# EAGLE schematic simpleBot (EAGLE 9.6.2)

## Sheet 1 of 2
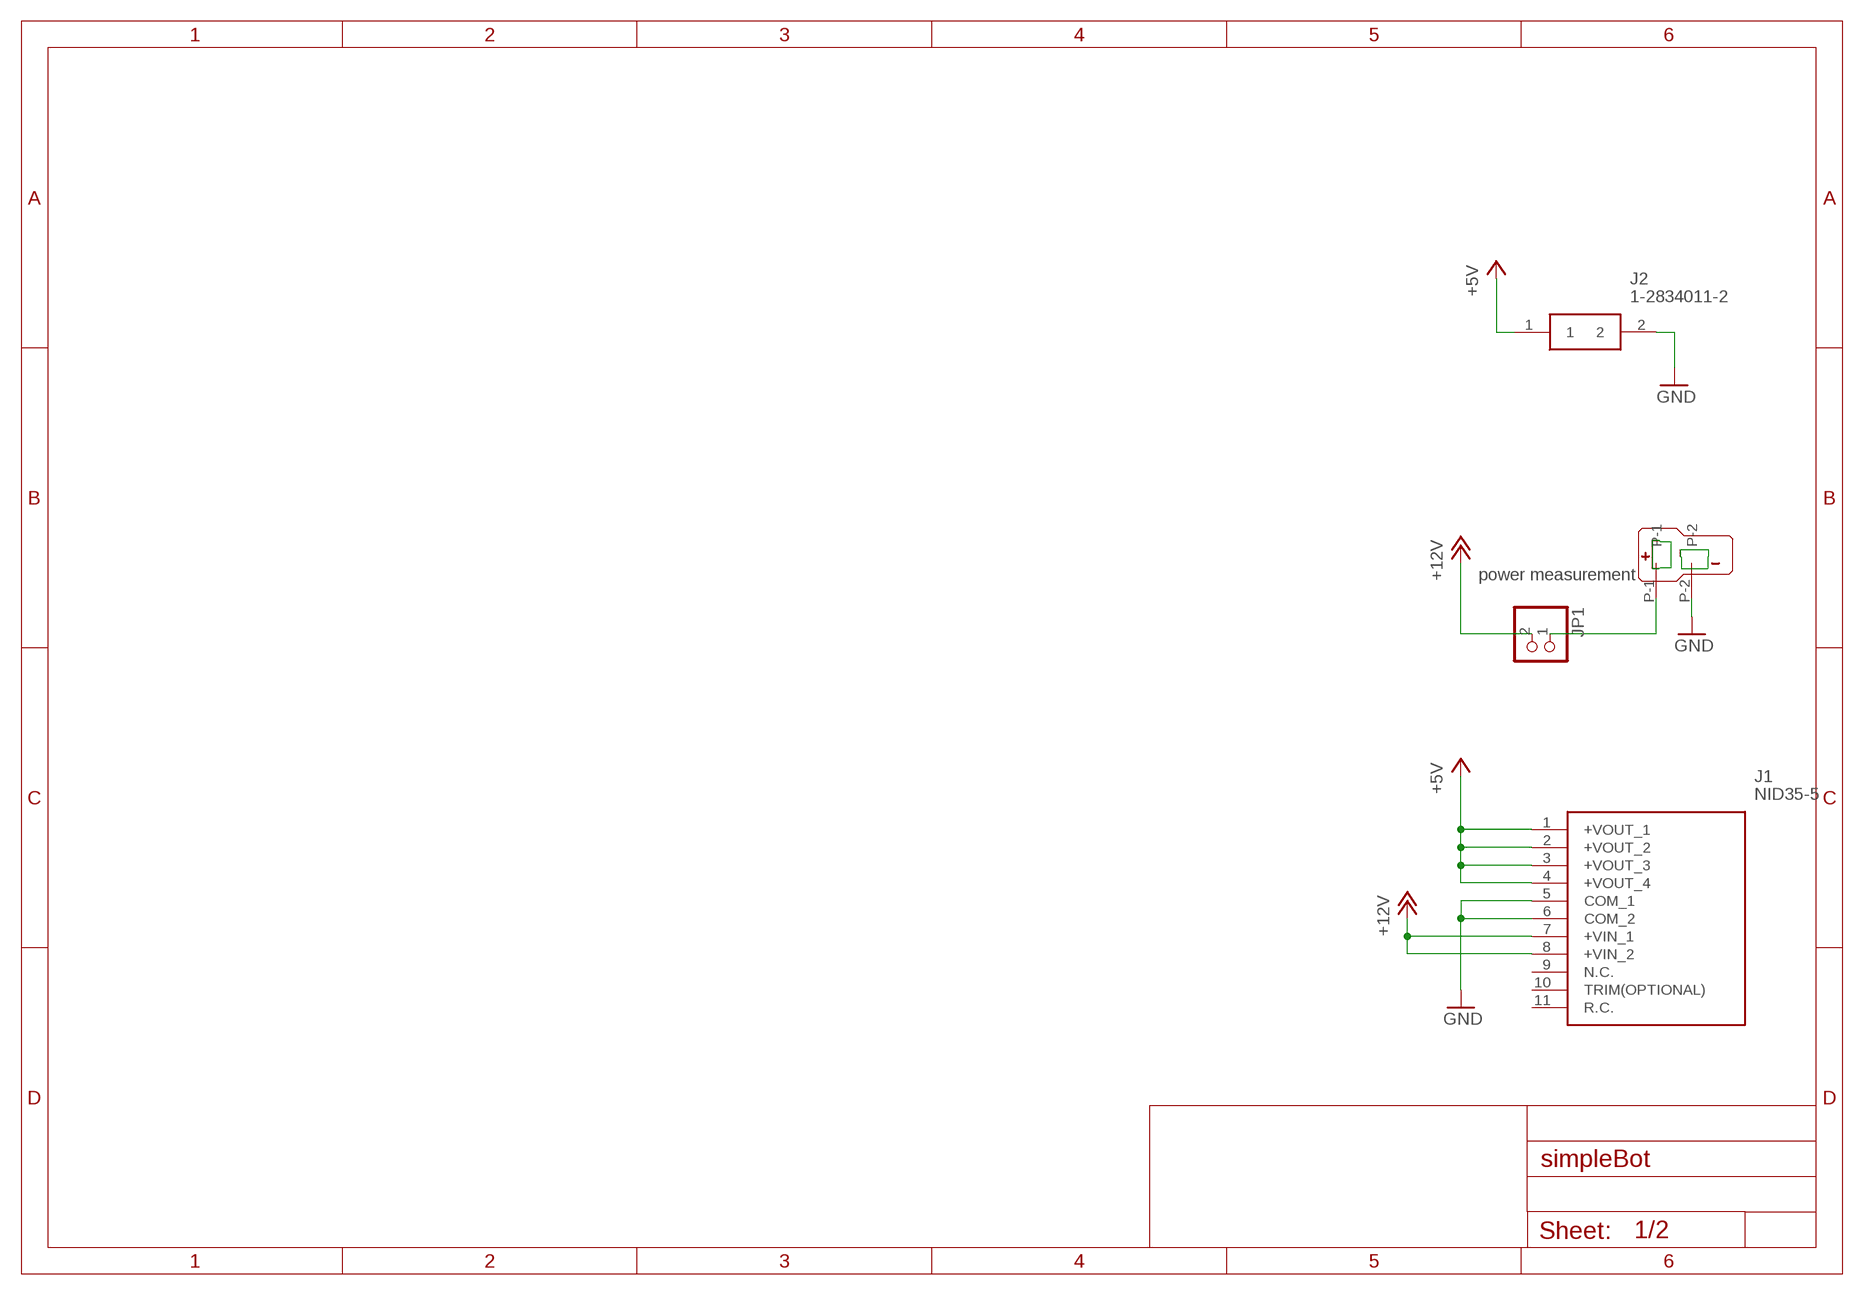
[diagram p0: schematic, sheet 1]

### Parts
J1  NID35-5  [NID355]
J2  1-2834011-2  [128340112]
JP1  PINHD-1X2  [1X02]
U$2  T-PLUG_CONNECTOR  [T_PLUG_CONNECTOR]

### Nets
+5V: J1.1(+VOUT_1) J1.2(+VOUT_2) J1.3(+VOUT_3) J1.4(+VOUT_4) J2.1
+12V: J1.7(+VIN_1) J1.8(+VIN_2) JP1.2
GND: J1.5(COM_1) J1.6(COM_2) J2.2 U$2.P-2 ; also sheet 2
N$3: JP1.1 U$2.P-1
Unconnected: J1.9(N.C.) J1.10(TRIM(OPTIONAL)) J1.11(R.C.)

### Notes on the sheet
- power measurement

## Sheet 2 of 2
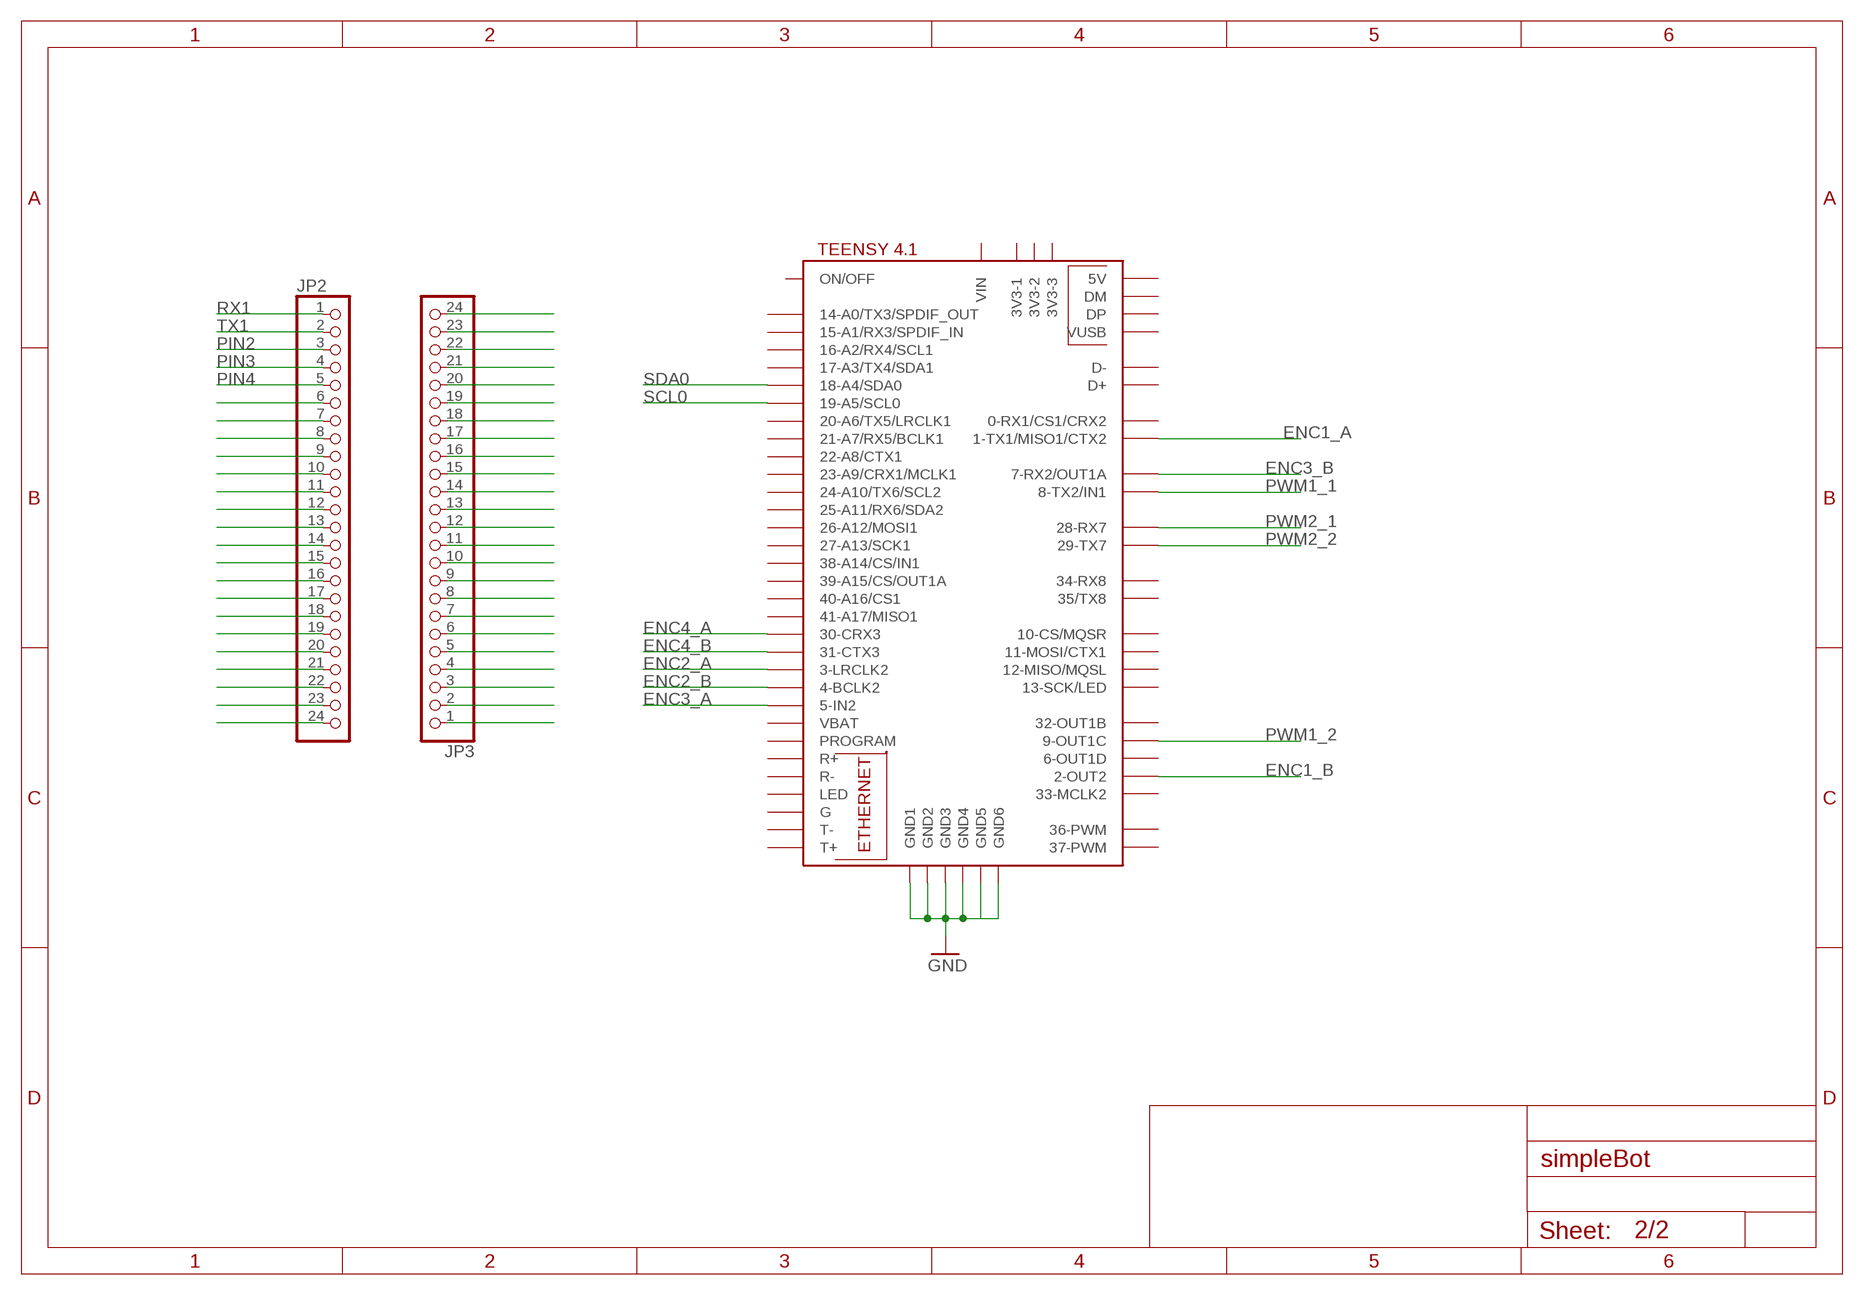
[diagram p1: schematic, sheet 2]

### Parts
JP2  PINHD-1X24  [1X24]
JP3  PINHD-1X24  [1X24]
U$1  TEENSY41  [TEENSY41]

### Nets
ENC1_A: U$1.1-TX1/MISO1/CTX2
ENC1_B: U$1.2-OUT2
ENC2_A: U$1.3-LRCLK2
ENC2_B: U$1.4-BCLK2
ENC3_A: U$1.5-IN2
ENC3_B: U$1.7-RX2/OUT1A
ENC4_A: U$1.30-CRX3
ENC4_B: U$1.31-CTX3
GND: U$1.GND1 U$1.GND2 U$1.GND3 U$1.GND4 U$1.GND5 U$1.GND6 ; also sheet 1
N$7: JP2.6
N$8: JP2.7
N$9: JP2.8
N$10: JP2.9
N$11: JP2.10
N$12: JP2.11
N$13: JP2.12
N$14: JP2.13
N$15: JP2.14
N$16: JP2.15
N$17: JP2.16
N$18: JP2.17
N$19: JP2.18
N$20: JP2.19
N$21: JP2.20
N$22: JP2.21
N$23: JP3.24
N$24: JP3.23
N$25: JP3.22
N$26: JP3.21
N$27: JP3.20
N$28: JP3.19
N$29: JP3.18
N$31: JP3.17
N$32: JP3.16
N$33: JP3.15
N$34: JP3.14
N$35: JP3.13
N$36: JP3.12
N$38: JP3.11
N$39: JP3.10
N$40: JP3.9
N$41: JP3.8
N$42: JP3.7
N$43: JP3.6
N$44: JP3.5
N$45: JP3.4
N$46: JP3.3
N$47: JP3.2
N$48: JP3.1
N$49: JP2.22
N$50: JP2.23
N$51: JP2.24
PIN2: JP2.3
PIN3: JP2.4
PIN4: JP2.5
PWM1_1: U$1.8-TX2/IN1
PWM1_2: U$1.9-OUT1C
PWM2_1: U$1.28-RX7
PWM2_2: U$1.29-TX7
RX1: JP2.1
SCL0: U$1.19-A5/SCL0
SDA0: U$1.18-A4/SDA0
TX1: JP2.2
Unconnected: U$1.0-RX1/CS1/CRX2 U$1.3V3-1 U$1.3V3-2 U$1.3V3-3 U$1.6-OUT1D U$1.10-CS\MQSR(10-CS/MQSR) U$1.11-MOSI/CTX1 U$1.12-MISO/MQSL U$1.13-SCK/LED U$1.14-A0/TX3/SPDIF_OUT U$1.15-A1/RX3/SPDIF_IN U$1.16-A2/RX4/SCL1 U$1.17-A3/TX4/SDA1 U$1.20-A6/TX5/LRCLK1 U$1.21-A7/RX5/BCLK1 U$1.22-A8/CTX1 U$1.23-A9/CRX1/MCLK1 U$1.24-A10/TX6/SCL2 U$1.25-A11/RX6/SDA2 U$1.26-A12/MOSI1 U$1.27-A13/SCK1 U$1.32-OUT1B U$1.33-MCLK2 U$1.34-RX8 U$1.35-TX8(35/TX8) U$1.36-PWM U$1.37-PWM U$1.38-A14/CS/IN1 U$1.39-A15/CS/OUT1A U$1.40-A16/CS1 U$1.41-A17/MISO1 U$1.+5V(5V) U$1.D+ U$1.D- U$1.DM U$1.DP U$1.G U$1.LED U$1.ON/OFF U$1.PROGRAM U$1.R+ U$1.R- U$1.T+ U$1.T- U$1.VBAT U$1.VIN U$1.VUSB

## Library data of the parts
J1 = NID35-5:NID35-5: Non-Isolated DC/DC Converters 17.5W 24Vin 5Vout Non-Iso Reg SIP Source: Datasheet <http://www.meanwellusa.com/webapp/product/search.aspx?prod=NID35#1>; DESCRIPTION: Non-Isolated DC/DC Converters 17.5W 24Vin 5Vout Non-Iso Reg SIP; HEIGHT: 13mm; MANUFACTURER_NAME: Mean Well; MANUFACTURER_PART_NUMBER: NID35-5
J2 = 1-2834011-2:1-2834011-2: 2P 3.5mm Top Entry Screwless Connector. TE Connectivity 3.5mm Pitch Vertical PCB Terminal Block with Solder Termination, Through Hole, 2 Way Source: Datasheet <http://uk.rs-online.com/web/p/products/1649131>; DESCRIPTION: 2P 3.5mm Top Entry Screwless Connector. TE Connectivity 3.5mm Pitch Vertical PCB Terminal Block with Solder Termination, Through Hole, 2 Way; HEIGHT: 11mm; MANUFACTURER_NAME: TE Connectivity; MANUFACTURER_PART_NUMBER: 1-2834011-2; RS_PART_NUMBER: 1649131; RS_PRICE-STOCK: http://uk.rs-online.com/web/p/products/1649131
JP1 = pinhead:PINHD-1X2: PIN HEADER
JP2 JP3 = pinhead:PINHD-1X24: PIN HEADER
U$1 = teensy:TEENSY41
U$2 = con-T-plug:T-PLUG_CONNECTOR